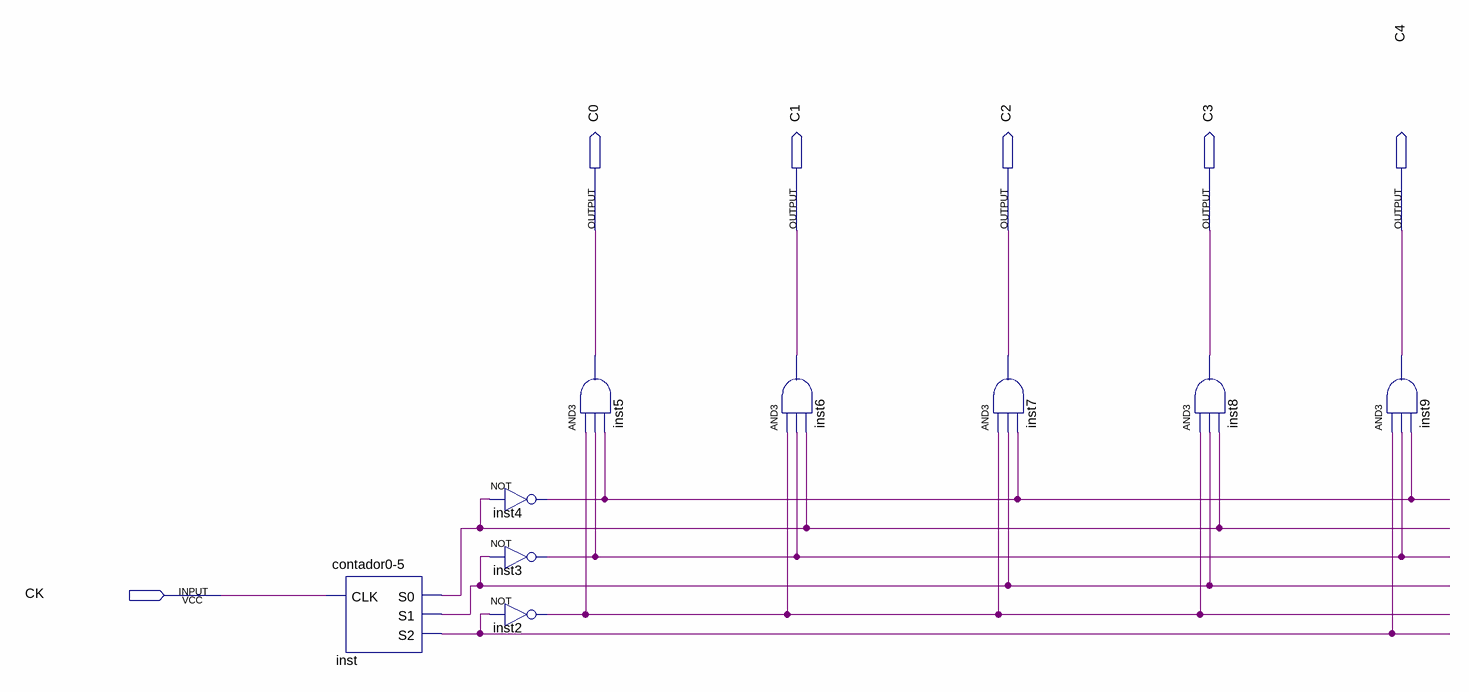
[diagram p0: schematic sheet]
// Quartus schematic seletor_coluna.bdf as structural Verilog: 9 symbols, 6 pins
module seletor_coluna (
  input  CK,
  output C0,
  output C1,
  output C2,
  output C3,
  output C4
);

  wire inst2_out, inst3_out, inst4_out, inst_s0, inst_s1, inst_s2;

  \contador0-5  inst (.CLK(CK), .S0(inst_s0), .S1(inst_s1), .S2(inst_s2));
  not inst4 (inst4_out, inst_s0);
  not inst3 (inst3_out, inst_s1);
  not inst2 (inst2_out, inst_s2);
  and inst5 (C0, inst2_out, inst3_out, inst4_out);
  and inst6 (C1, inst2_out, inst3_out, inst_s0);
  and inst7 (C2, inst2_out, inst_s1, inst4_out);
  and inst8 (C3, inst2_out, inst_s1, inst_s0);
  and inst9 (C4, inst_s2, inst3_out, inst4_out);
endmodule
